# EAGLE schematic carcomputer_split2 (EAGLE 9.3.2)

## Sheet 1 of 2
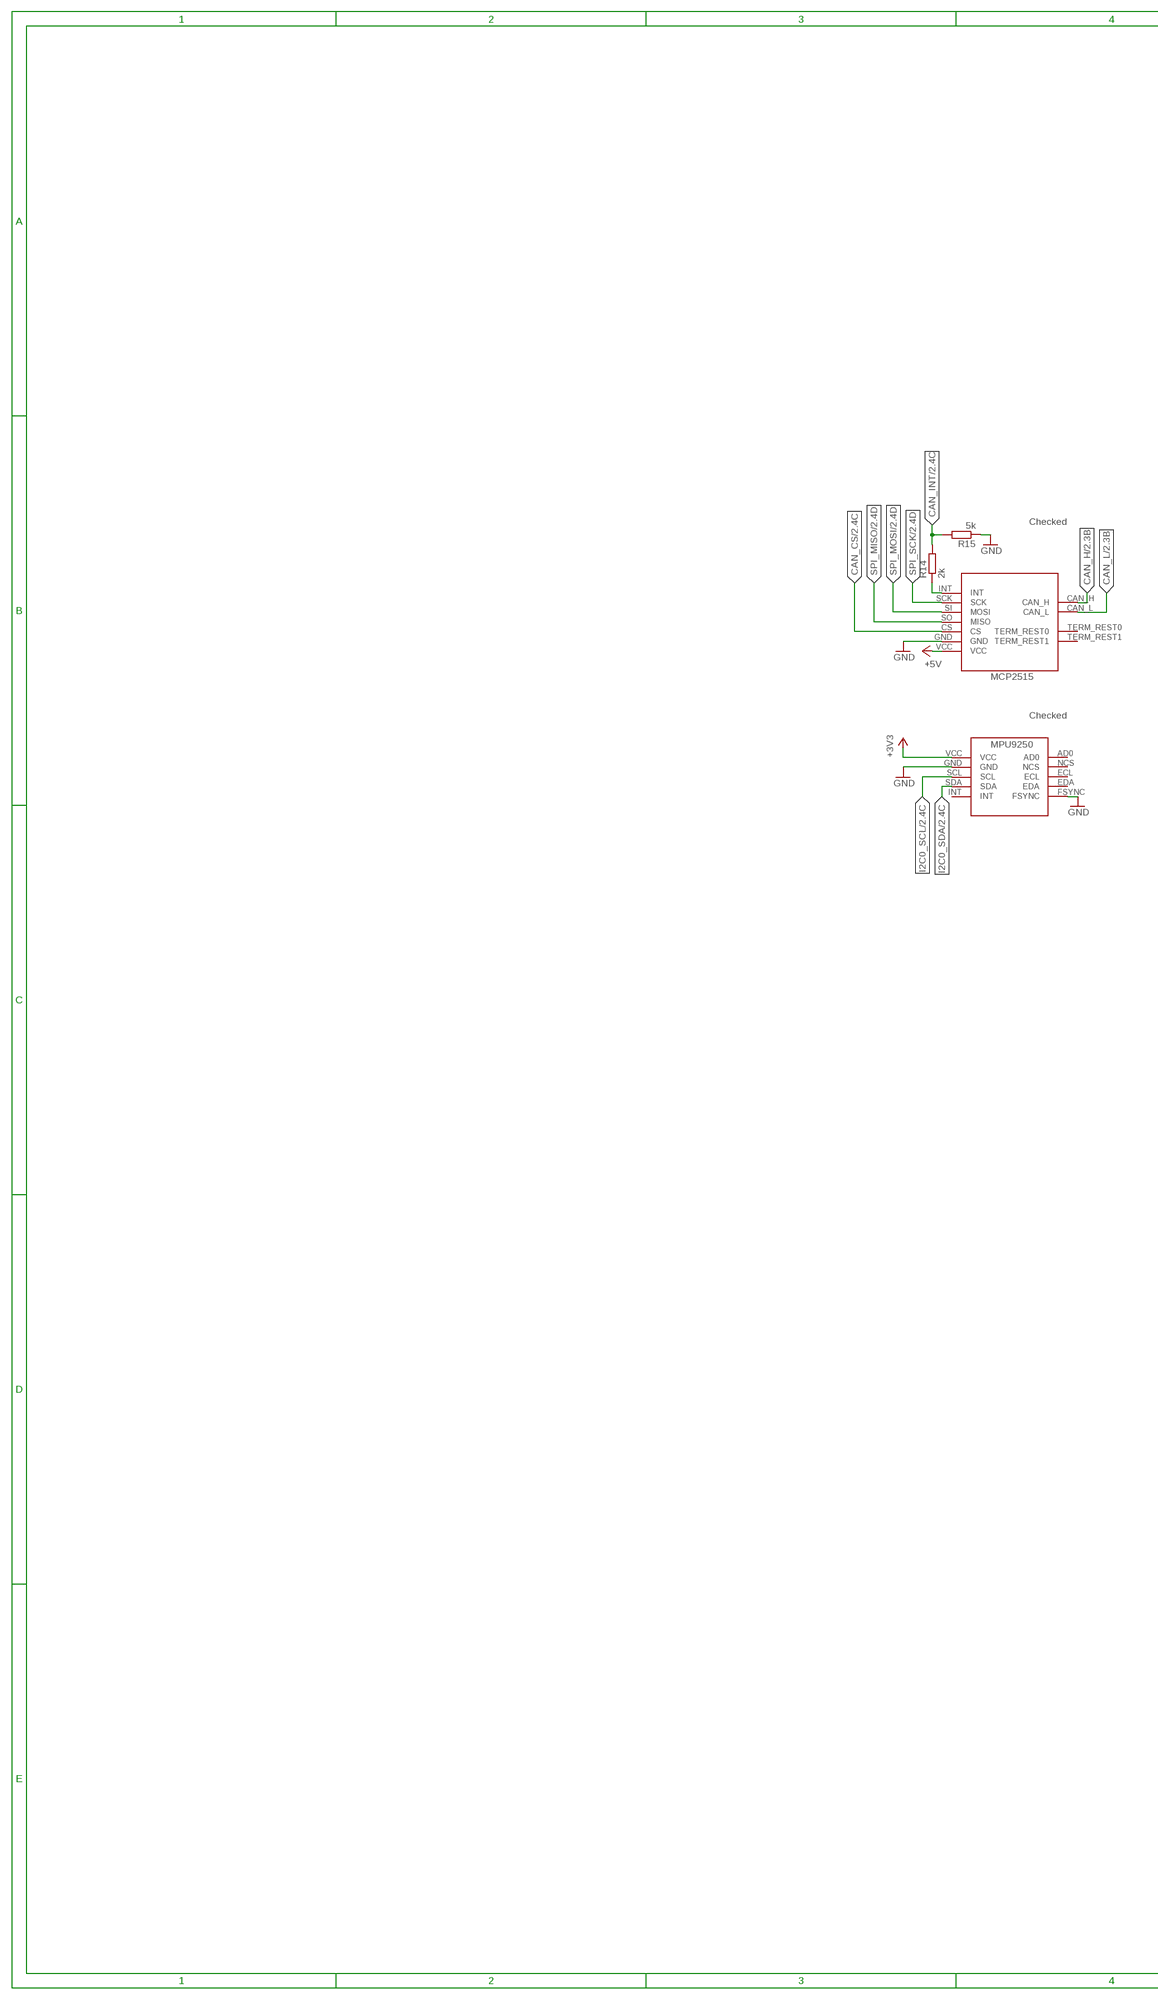
[diagram p0: schematic, sheet 1, part 1 of 2]
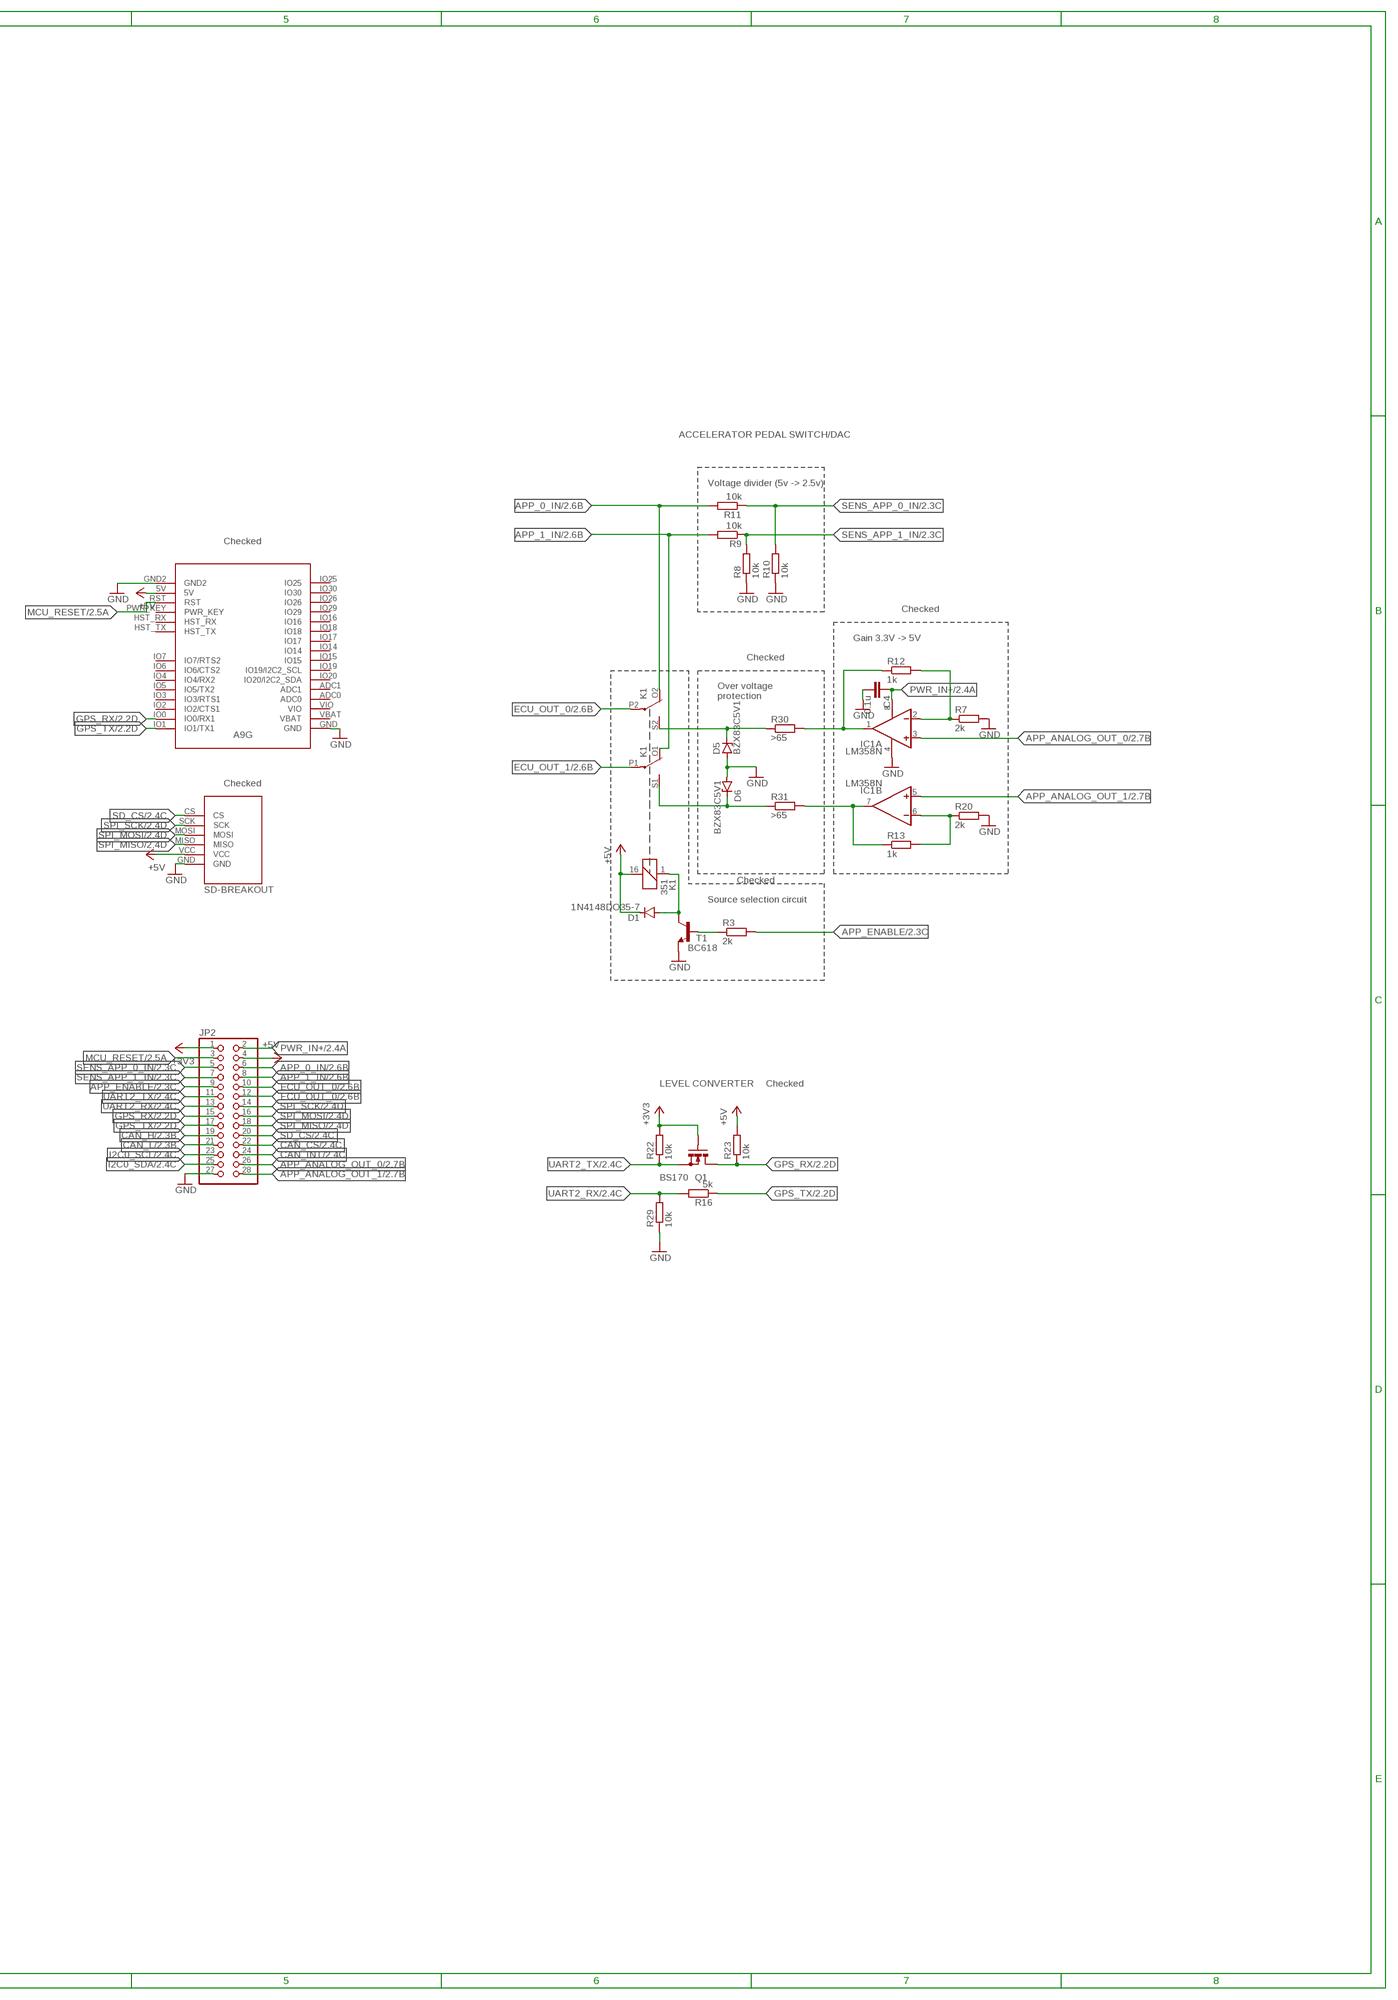
[diagram p1: schematic, sheet 1, part 2 of 2]

### Parts
C4  0.1u  C-EU025-050X050  [C025-050X050]
D1  1N4148DO35-7  [DO35-7]
D5  BZX83C5V1  BZX85  [DO41Z10]
D6  BZX83C5V1  BZX85  [DO41Z10]
IC1  LM358N  [DIL08]
JP2  PINHD-2X14  [2X14]
K1  351  [351]
Q1  BS170  [SOT54E]
R3  2k  R-EU_0207/7  [0207/7]
R7  2k  R-EU_0207/7  [0207/7]
R8  10k  R-EU_0207/7  [0207/7]
R9  10k  R-EU_0207/7  [0207/7]
R10  10k  R-EU_0207/7  [0207/7]
R11  10k  R-EU_0207/7  [0207/7]
R12  1k  R-EU_0207/7  [0207/7]
R13  1k  R-EU_0207/7  [0207/7]
R14  2k  R-EU_0207/7  [0207/7]
R15  5k  R-EU_0207/7  [0207/7]
R16  5k  R-EU_0207/7  [0207/7]
R20  2k  R-EU_0207/7  [0207/7]
R22  10k  R-EU_0207/7  [0207/7]
R23  10k  R-EU_0207/7  [0207/7]
R29  10k  R-EU_0207/7  [0207/7]
R30  >65  R-EU_0207/7  [0207/7]
R31  >65  R-EU_0207/7  [0207/7]
T1  BC618  [TO92-EBC]
U$2  MCP2515_DEVBOARDINVERTED  [MCP2515_DEVBOARD_INVERTED]
U$3  MPU9250_BREAKOUT  [MPU9250_BREAKOUT]
U$5  HKD-MICRO-SD-BREAKOUT  [HKD-MICRO-SD-BREAKOUT]
U$6  A9G  [A9G]

### Nets
+3V3: JP2.1 Q1.G R22.2 U$3.VCC ; also sheet 2
+5V: D1.C JP2.4 K1.16 R23.2 U$2.VCC U$5.VCC U$6.5V ; also sheet 2
APP_0_IN: JP2.6 K1.O2(3:O) R11.2 ; also sheet 2
APP_1_IN: JP2.8 K1.O1(2:O) R9.2 ; also sheet 2
APP_ANALOG_OUT_0: IC1.3(A:+IN) JP2.26 ; also sheet 2
APP_ANALOG_OUT_1: IC1.5(B:+IN) JP2.28 ; also sheet 2
APP_ENABLE: JP2.9 R3.2 ; also sheet 2
CAN_CS: JP2.22 U$2.CS ; also sheet 2
CAN_H: JP2.19 U$2.CAN_H ; also sheet 2
CAN_INT: JP2.24 R14.2 R15.2 ; also sheet 2
CAN_L: JP2.21 U$2.CAN_L ; also sheet 2
ECU_OUT_0: JP2.10 JP2.12 K1.P2(3:P) ; also sheet 2
ECU_OUT_1: K1.P1(2:P) ; also sheet 2
GND: C4.2 D5.A D6.A IC1.4(P:V-) JP2.27 R7.2 R8.1 R10.1 R15.1 R20.2 R29.1 T1.E U$2.GND U$3.FSYNC U$3.GND U$5.GND U$6.GND U$6.GND2 ; also sheet 2
GPS_RX: JP2.15 Q1.D R23.1 U$6.IO0(IO0/RX1) ; also sheet 2
GPS_TX: JP2.17 R16.1 U$6.IO1(IO1/TX1) ; also sheet 2
I2C0_SCL: JP2.23 U$3.SCL ; also sheet 2
I2C0_SDA: JP2.25 U$3.SDA ; also sheet 2
MCU_RESET: JP2.3 U$6.RST ; also sheet 2
N$1: D1.A K1.1 T1.C
N$2: R3.1 T1.B
N$3: D6.C K1.S1(2:S) R31.1
N$4: IC1.1(A:OUT) R12.1 R30.2
N$10: R14.1 U$2.INT
N$13: IC1.2(A:-IN) R7.1 R12.2
N$16: IC1.6(B:-IN) R13.2 R20.1
N$17: D5.C K1.S2(3:S) R30.1
N$18: IC1.7(B:OUT) R13.1 R31.2
PWR_IN+: C4.1 IC1.8(P:V+) JP2.2 ; also sheet 2
SD_CS: JP2.20 U$5.CS ; also sheet 2
SENS_APP_0_IN: JP2.5 R10.2 R11.1 ; also sheet 2
SENS_APP_1_IN: JP2.7 R8.2 R9.1 ; also sheet 2
SPI_MISO: JP2.18 U$2.SO(MISO) U$5.MISO ; also sheet 2
SPI_MOSI: JP2.16 U$2.SI(MOSI) U$5.MOSI ; also sheet 2
SPI_SCK: JP2.14 U$2.SCK U$5.SCK ; also sheet 2
UART2_RX: JP2.13 R16.2 R29.2 ; also sheet 2
UART2_TX: JP2.11 Q1.S R22.1 ; also sheet 2
Unconnected: U$2.TERM_REST0 U$2.TERM_REST1 U$3.AD0 U$3.ECL U$3.EDA U$3.INT U$3.NCS U$6.ADC0 U$6.ADC1 U$6.HST_RX U$6.HST_TX U$6.IO2(IO2/CTS1) U$6.IO3(IO3/RTS1) U$6.IO4(IO4/RX2) U$6.IO5(IO5/TX2) U$6.IO6(IO6/CTS2) U$6.IO7(IO7/RTS2) U$6.IO14 U$6.IO15 U$6.IO16 U$6.IO17 U$6.IO18 U$6.IO19(IO19/I2C2_SCL) U$6.IO20(IO20/I2C2_SDA) U$6.IO25 U$6.IO26 U$6.IO29 U$6.IO30 U$6.PWR_KEY U$6.VBAT U$6.VIO

### Notes on the sheet
- ACCELERATOR PEDAL SWITCH/DAC
- Voltage divider (5v -> 2.5v)
- Checked
- Checked
- Checked
- Gain 3.3V -> 5V
- Checked
- Over voltage
  protection
- Checked
- Checked
- Checked
- Source selection circuit
- LEVEL CONVERTER | Checked

## Sheet 2 of 2
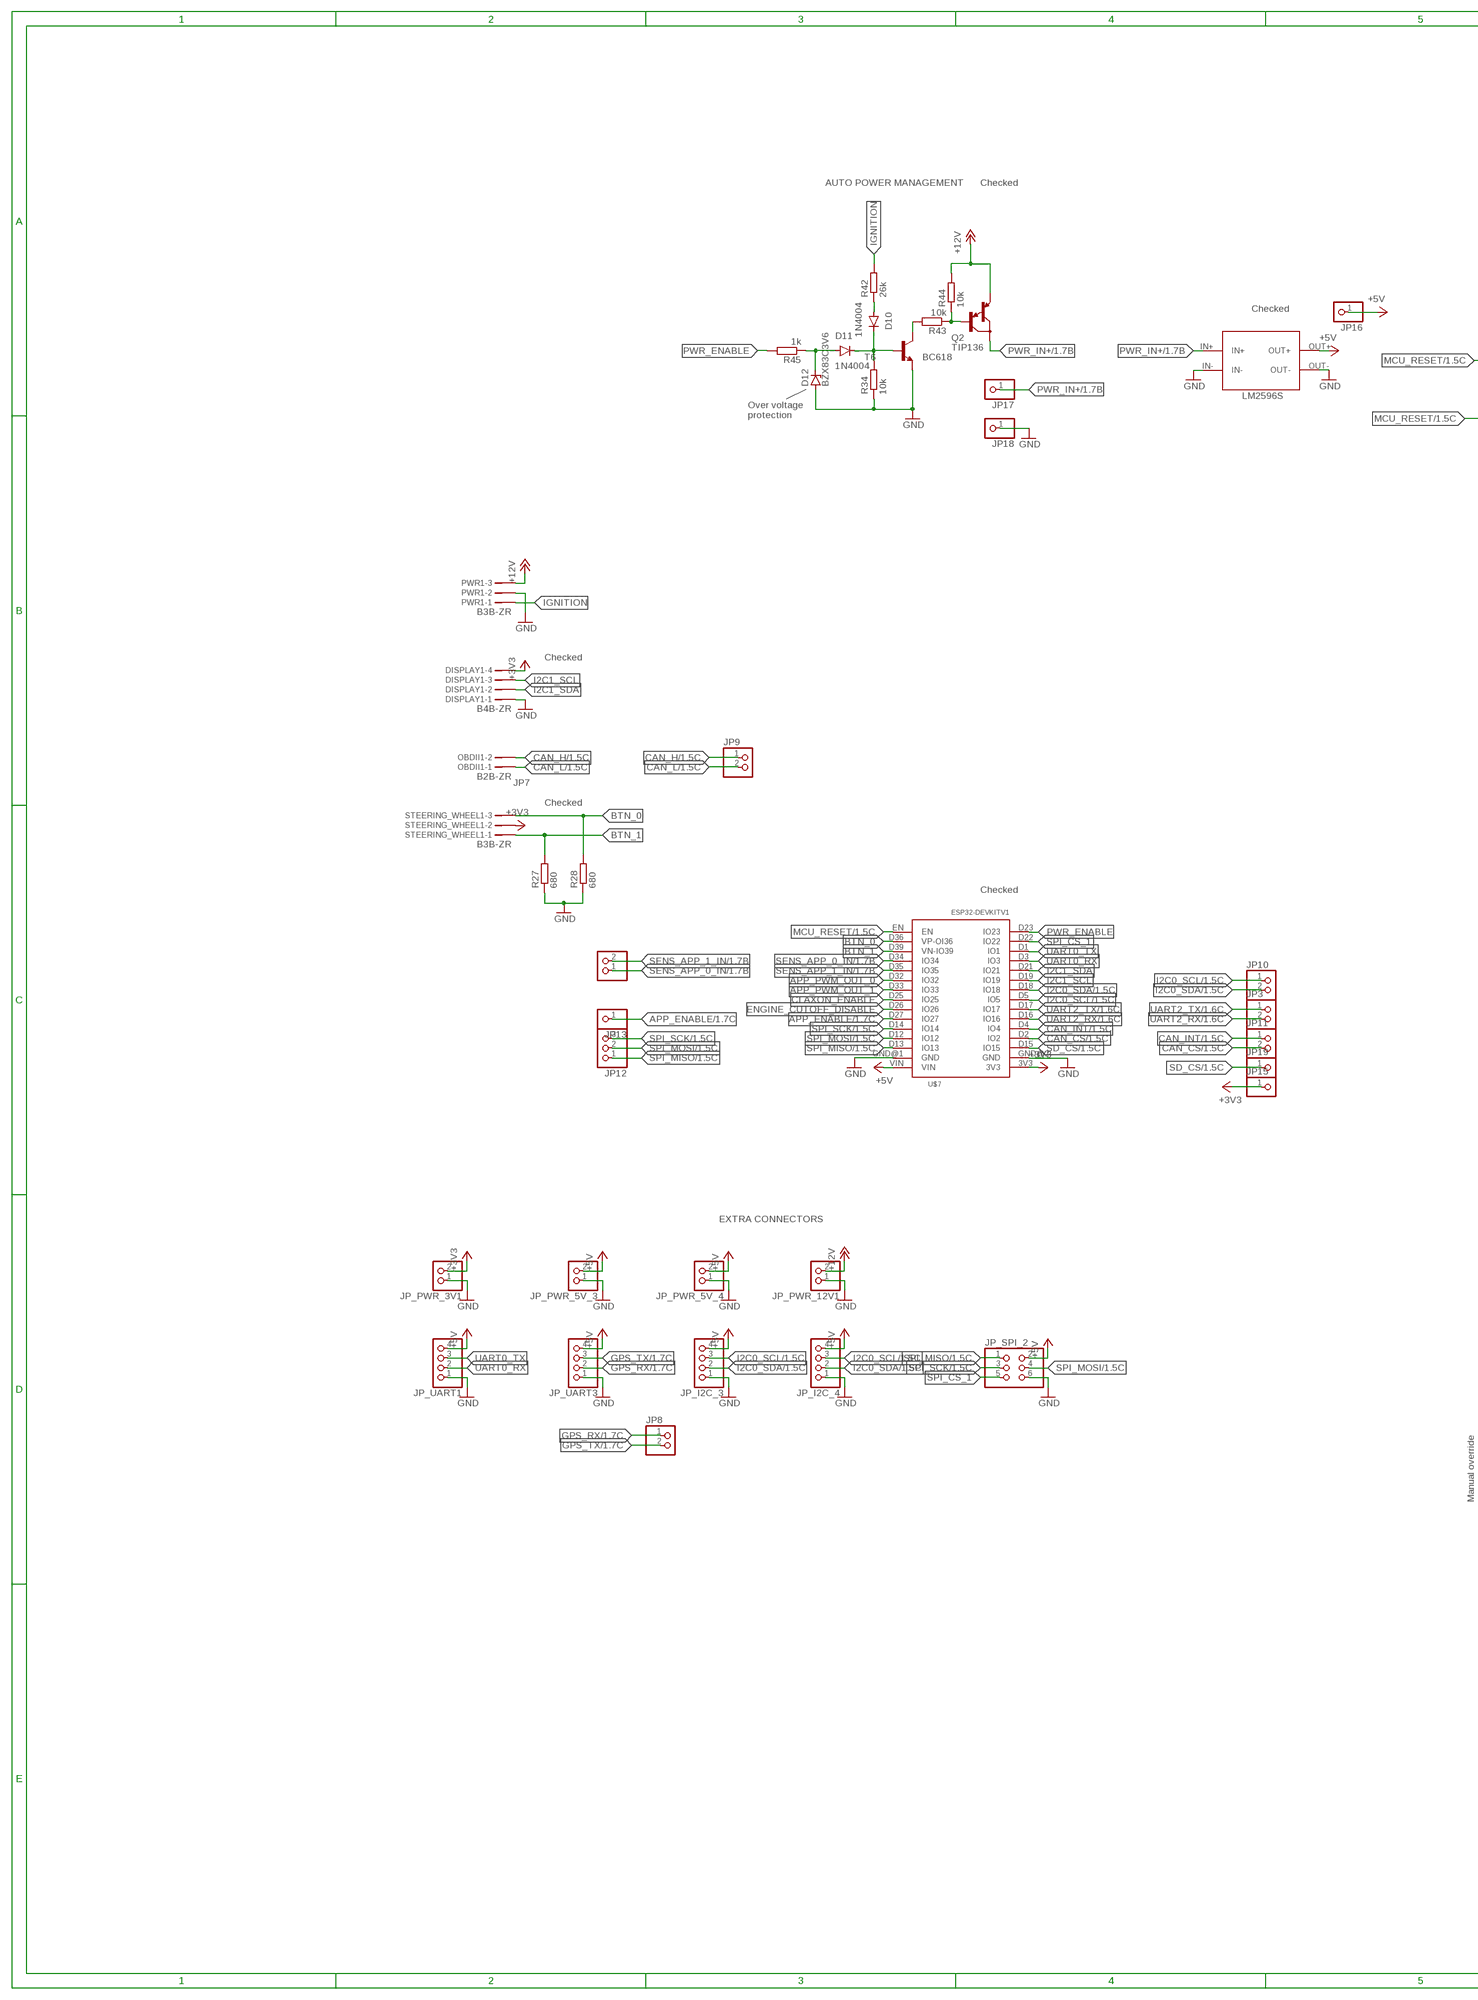
[diagram p2: schematic, sheet 2, part 1 of 2]
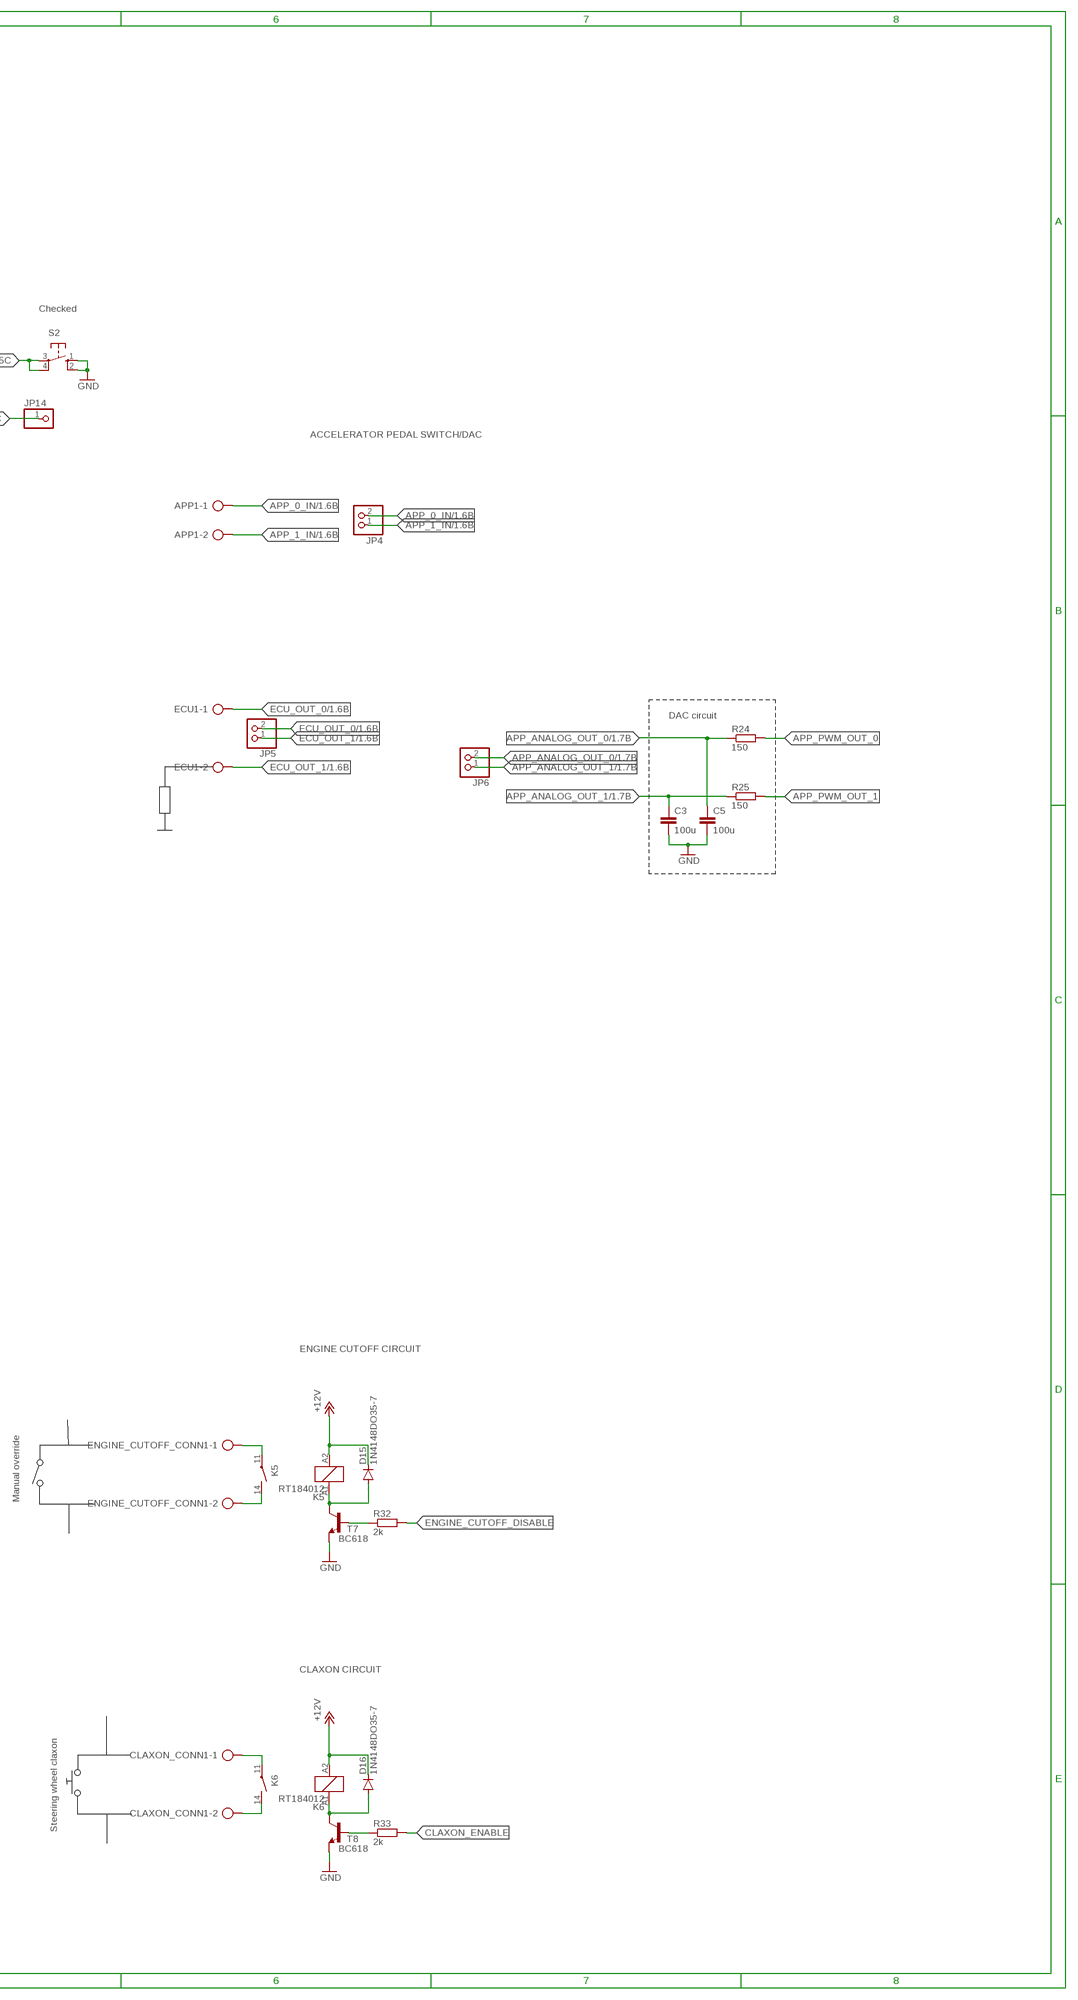
[diagram p3: schematic, sheet 2, part 2 of 2]

### Parts
APP1  AK300/2  [AK300/2]
C3  100u  C-EU025-050X050  [C025-050X050]
C5  100u  C-EU025-050X050  [C025-050X050]
CLAXON_CONN1  AK300/2  [AK300/2]
D10  1N4004  [DO41-10]
D11  1N4004  [DO41-10]
D12  BZX83C3V6  BZX85  [DO41Z10]
D15  1N4148DO35-7  [DO35-7]
D16  1N4148DO35-7  [DO35-7]
DISPLAY1  B4B-ZR  [B4B-ZR]
ECU1  AK300/2  [AK300/2]
ENGINE_CUTOFF_CONN1  AK300/2  [AK300/2]
JP3  PINHD-1X2  [1X02]
JP4  PINHD-1X2  [1X02]
JP5  PINHD-1X2  [1X02]
JP6  PINHD-1X2  [1X02]
JP7  PINHD-1X2  [1X02]
JP8  PINHD-1X2  [1X02]
JP9  PINHD-1X2  [1X02]
JP10  PINHD-1X2  [1X02]
JP11  PINHD-1X2  [1X02]
JP12  PINHD-1X3  [1X03]
JP13  PINHD-1X1  [1X01]
JP14  PINHD-1X1  [1X01]
JP15  PINHD-1X1  [1X01]
JP16  PINHD-1X1  [1X01]
JP17  PINHD-1X1  [1X01]
JP18  PINHD-1X1  [1X01]
JP19  PINHD-1X1  [1X01]
JP_I2C_3  PINHD-1X4  [1X04]
JP_I2C_4  PINHD-1X4  [1X04]
JP_PWR_3V1  PINHD-1X2  [1X02]
JP_PWR_5V_3  PINHD-1X2  [1X02]
JP_PWR_5V_4  PINHD-1X2  [1X02]
JP_PWR_12V1  PINHD-1X2  [1X02]
JP_SPI_2  PINHD-2X3  [2X03]
JP_UART1  PINHD-1X4  [1X04]
JP_UART3  PINHD-1X4  [1X04]
K5  RT184012  [RT-N/O12A3.5]
K6  RT184012  [RT-N/O12A3.5]
OBDII1  B2B-ZR  [B2B-ZR]
PWR1  B3B-ZR  [B3B-ZR]
Q2  TIP136  [TO220]
R24  150  R-EU_0207/7  [0207/7]
R25  150  R-EU_0207/7  [0207/7]
R27  680  R-EU_0207/7  [0207/7]
R28  680  R-EU_0207/7  [0207/7]
R32  2k  R-EU_0207/7  [0207/7]
R33  2k  R-EU_0207/7  [0207/7]
R34  10k  R-EU_0207/7  [0207/7]
R42  26k  R-EU_0207/7  [0207/7]
R43  10k  R-EU_0207/7  [0207/7]
R44  10k  R-EU_0207/7  [0207/7]
R45  1k  R-EU_0207/7  [0207/7]
S2  10-XX  [B3F-10XX]
STEERING_WHEEL1  B3B-ZR  [B3B-ZR]
T6  BC618  [TO92-EBC]
T7  BC618  [TO92-EBC]
T8  BC618  [TO92-EBC]
U$7  ESP32DEVKITV1  [ESP32-DEVKITV1]
U$10  LM2596S  [LM2596S]

### Nets
+3V3: DISPLAY1.4 JP15.1 JP_PWR_3V1.2 STEERING_WHEEL1.2 U$7.3V3 ; also sheet 1
+5V: JP16.1 JP_I2C_3.4 JP_I2C_4.4 JP_PWR_5V_3.2 JP_PWR_5V_4.2 JP_SPI_2.2 JP_UART1.4 JP_UART3.4 U$7.VIN U$10.OUT+ ; also sheet 1
+12V: D15.C D16.C JP_PWR_12V1.2 K5.A2 K6.A2 PWR1.3 Q2.3(E) R44.2
APP_0_IN: APP1.1 JP4.2 ; also sheet 1
APP_1_IN: APP1.2 JP4.1 ; also sheet 1
APP_ANALOG_OUT_0: C5.1 JP6.2 R24.1 ; also sheet 1
APP_ANALOG_OUT_1: C3.1 JP6.1 R25.1 ; also sheet 1
APP_ENABLE: JP13.1 U$7.D27(IO27) ; also sheet 1
APP_PWM_OUT_0: R24.2 U$7.D32(IO32)
APP_PWM_OUT_1: R25.2 U$7.D33(IO33)
BTN_0: R28.2 STEERING_WHEEL1.3 U$7.D36(VP-OI36)
BTN_1: R27.2 STEERING_WHEEL1.1 U$7.D39(VN-IO39)
CAN_CS: JP11.2 U$7.D2(IO2) ; also sheet 1
CAN_H: JP9.1 OBDII1.2 ; also sheet 1
CAN_INT: JP11.1 U$7.D4(IO4) ; also sheet 1
CAN_L: JP9.2 OBDII1.1 ; also sheet 1
CLAXON_ENABLE: R33.2 U$7.D25(IO25)
ECU_OUT_0: ECU1.1 JP5.2 ; also sheet 1
ECU_OUT_1: ECU1.2 JP5.1 ; also sheet 1
ENGINE_CUTOFF_DISABLE: R32.2 U$7.D26(IO26)
GND: C3.2 C5.2 D12.A DISPLAY1.1 JP18.1 JP_I2C_3.1 JP_I2C_4.1 JP_PWR_3V1.1 JP_PWR_5V_3.1 JP_PWR_5V_4.1 JP_PWR_12V1.1 JP_SPI_2.6 JP_UART1.1 JP_UART3.1 PWR1.2 R27.1 R28.1 R34.1 S2.1(S) S2.2(S1) T6.E T7.E T8.E U$7.GND@1(GND) U$7.GND@2(GND) U$10.IN- U$10.OUT- ; also sheet 1
GPS_RX: JP8.1 JP_UART3.2 ; also sheet 1
GPS_TX: JP8.2 JP_UART3.3 ; also sheet 1
I2C0_SCL: JP10.1 JP_I2C_3.3 JP_I2C_4.3 U$7.D5(IO5) ; also sheet 1
I2C0_SDA: JP10.2 JP_I2C_3.2 JP_I2C_4.2 U$7.D18(IO18) ; also sheet 1
I2C1_SCL: DISPLAY1.3 U$7.D19(IO19)
I2C1_SDA: DISPLAY1.2 U$7.D21(IO21)
IGNITION: PWR1.1 R42.2
MCU_RESET: JP14.1 S2.3(P) S2.4(P1) U$7.EN ; also sheet 1
N$33: D10.C D11.C R34.2 T6.B
N$35: D10.A R42.1
N$36: Q2.1(B) R43.1 R44.1
N$37: R43.2 T6.C
N$38: D11.A D12.C R45.1
N$45: D15.A K5.A1 T7.C
N$46: R32.1 T7.B
N$47: ENGINE_CUTOFF_CONN1.1 K5.11(2:P)
N$48: ENGINE_CUTOFF_CONN1.2 K5.14(2:S)
N$49: D16.A K6.A1 T8.C
N$50: R33.1 T8.B
N$51: CLAXON_CONN1.1 K6.11(2:P)
N$52: CLAXON_CONN1.2 K6.14(2:S)
PWR_ENABLE: R45.2 U$7.D23(IO23)
PWR_IN+: JP17.1 Q2.2(C) U$10.IN+ ; also sheet 1
SD_CS: JP19.1 U$7.D15(IO15) ; also sheet 1
SENS_APP_0_IN: JP3.1 U$7.D34(IO34) ; also sheet 1
SENS_APP_1_IN: JP3.2 U$7.D35(IO35) ; also sheet 1
SPI_CS_1: JP_SPI_2.5 U$7.D22(IO22)
SPI_MISO: JP12.1 JP_SPI_2.1 U$7.D13(IO13) ; also sheet 1
SPI_MOSI: JP12.2 JP_SPI_2.4 U$7.D12(IO12) ; also sheet 1
SPI_SCK: JP12.3 JP_SPI_2.3 U$7.D14(IO14) ; also sheet 1
UART0_RX: JP_UART1.2 U$7.D3(IO3)
UART0_TX: JP_UART1.3 U$7.D1(IO1)
UART2_RX: JP7.2 U$7.D16(IO16) ; also sheet 1
UART2_TX: JP7.1 U$7.D17(IO17) ; also sheet 1

### Notes on the sheet
- AUTO POWER MANAGEMENT | Checked
- Checked | Checked
- Over voltage
  protection
- ACCELERATOR PEDAL SWITCH/DAC
- Checked
- DAC circuit
- Checked
- Checked
- EXTRA CONNECTORS
- ENGINE CUTOFF CIRCUIT
- Manual override
- CLAXON CIRCUIT
- Steering wheel claxon

## Library data of the parts
APP1 CLAXON_CONN1 ECU1 ENGINE_CUTOFF_CONN1 = con-ptr500-custom:AK300/2: CONNECTOR; OC_FARNELL: unknown; OC_NEWARK: unknown
C3-C5 = rcl:C-EU: CAPACITOR, European symbol; SPICEPREFIX: C
D1 D15 D16 = diode:1N4148: DIODE high speed (Philips)
D5 D6 D12 = diode:BZX85: Z DIODE
D10 D11 = diode:1N4004: DIODE general purpose rectifier, 1 A
DISPLAY1 = con-jst-custom:?4B-ZR: ZH CONNECTOR 1.5 mm, 4 pin 1 row Source: http://www.jst.com .. eZH.pdf; MF: FARNELL; MPN: B4B-ZR(LF)(SN); OC_FARNELL: 1830916; OC_NEWARK: 37K9960
IC1 = linear:LM358: OP AMP also LM158; LM258; LM2904 Source: http://cache.national.com/ds/LM/LM158.pdf
JP2 = pinhead:PINHD-2X14: PIN HEADER
JP3-JP11 JP_PWR_3V1 JP_PWR_5V_3 JP_PWR_5V_4 JP_PWR_12V1 = pinhead:PINHD-1X2: PIN HEADER
JP12 = pinhead:PINHD-1X3: PIN HEADER
JP13-JP19 = pinhead:PINHD-1X1: PIN HEADER
JP_I2C_3 JP_I2C_4 JP_UART1 JP_UART3 = pinhead:PINHD-1X4: PIN HEADER
JP_SPI_2 = pinhead:PINHD-2X3: PIN HEADER
K1 = relay:351: RELAY 2 x switch, Omron; OC_FARNELL: unknown; OC_NEWARK: unknown
K5 K6 = relay:RT?*: Power PCB Relay SCHRACK 1 pole 12 / 16 A, DC- or AC-coil Source: http://www.schrack.com/.. 5819.pdf; MF: TYCO ELECTRONICS; MPN: RT184012; OC_FARNELL: unknown; OC_NEWARK: 08H3731
OBDII1 = con-jst-custom:?2B-ZR: ZH CONNECTOR 1.5 mm, 4 pin 1 row Source: http://www.jst.com .. eZH.pdf
PWR1 STEERING_WHEEL1 = con-jst-custom:?3B-ZR: ZH CONNECTOR 1.5 mm, 4 pin 1 row Source: http://www.jst.com .. eZH.pdf
Q1 = transistor-small-signal:BS170: N-CHANNEL MOS FET
Q2 = transistor-pnp:TIP136: PNP Darlington Transistor
R3 R7-R16 R20 R22-R25 R27-R34 R42-R45 = rcl:R-EU_: RESISTOR, European symbol; SPICEPREFIX: R
S2 = switch-omron:10-XX: OMRON SWITCH; MPN: B3F-1000; OC_FARNELL: 176432; OC_NEWARK: 36M3542
T1 T6-T8 = transistor-npn:BC618*: NPN Transistor
U$2 = MCP2515:MCP2515_DEVBOARD
U$3 = MPU9250:MPU9250_BREAKOUT
U$5 = sd-mmc:HKD-MICRO-SD-BREAKOUT
U$6 = A9:A9G
U$7 = ESP32-DEVKITV1:ESP32DEVKITV1
U$10 = PSU:LM2596S